# EAGLE design PetFeeder2 (EAGLE 9.6.2)
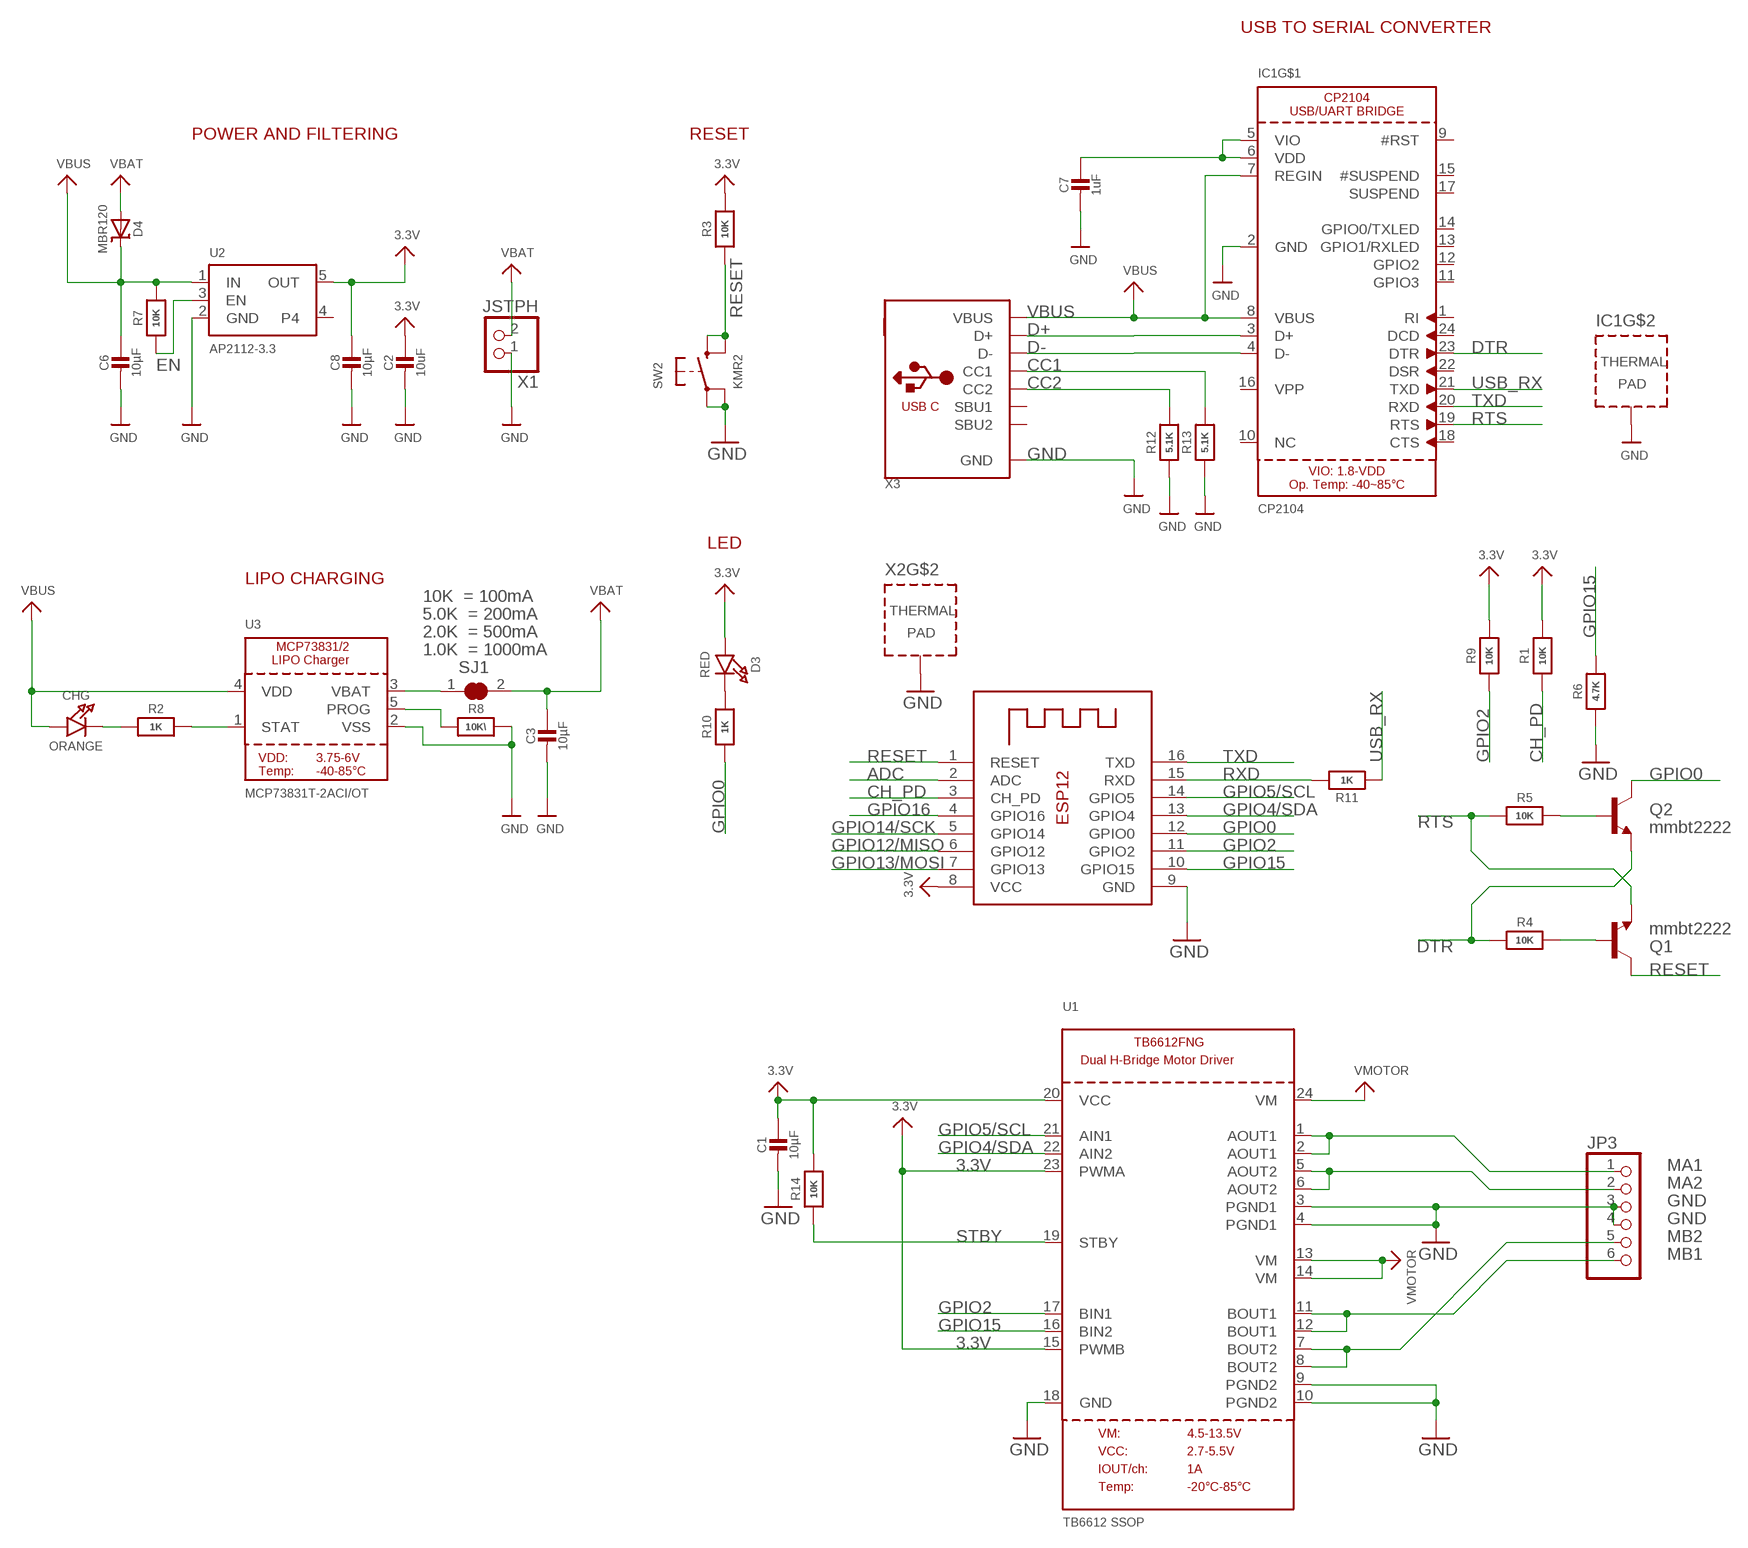
[diagram p0: schematic, sheet 1]

## Parts
C1  10µF  CAP_CERAMIC0805-NOOUTLINE  [0805-NO]
C2  10uF  CAP_CERAMIC0805-NOOUTLINE  [0805-NO]
C3  10µF  CAP_CERAMIC0805-NOOUTLINE  [0805-NO]
C6  10µF  CAP_CERAMIC0805-NOOUTLINE  [0805-NO]
C7  1uF  CAP_CERAMIC0603_NO  [0603-NO]
C8  10µF  CAP_CERAMIC0805-NOOUTLINE  [0805-NO]
CHG  ORANGE  LED0805_NOOUTLINE  [CHIPLED_0805_NOOUTLINE]
D3  RED  LED0805_NOOUTLINE  [CHIPLED_0805_NOOUTLINE]
D4  MBR120  DIODE-SCHOTTKYSOD-123  [SOD-123]
IC1  CP2104  [QFN24_4MM_SMSC]
JP3  PINHD-1X6CB  [1X06-CLEANBIG]
Q1  mmbt2222  TRANSISTOR_NPNSOT23-3  [SOT23-3]
Q2  mmbt2222  TRANSISTOR_NPNSOT23-3  [SOT23-3]
R1  10K  RESISTOR_0603_NOOUT  [0603-NO]
R2  1K  RESISTOR_0603_NOOUT  [0603-NO]
R3  10K  RESISTOR_0603_NOOUT  [0603-NO]
R4  10K  RESISTOR_0603_NOOUT  [0603-NO]
R5  10K  RESISTOR_0603_NOOUT  [0603-NO]
R6  4.7K  RESISTOR_0603_NOOUT  [0603-NO]
R7  10K  RESISTOR_0603_NOOUT  [0603-NO]
R8  10K\  RESISTOR_0603_NOOUT  [0603-NO]
R9  10K  RESISTOR_0603_NOOUT  [0603-NO]
R10  1K  RESISTOR_0603_NOOUT  [0603-NO]
R11  1K  RESISTOR_0603MP  [_0603MP]
R12  5.1K  RESISTOR_0603_NOOUT  [0603-NO]
R13  5.1K  RESISTOR_0603_NOOUT  [0603-NO]
R14  10K  RESISTOR0805_NOOUTLINE  [0805-NO]
SJ1  SOLDERJUMPER_CLOSED  [SOLDERJUMPER_CLOSEDWIRE]
SW2  KMR2  SWITCH_TACT_SMT4.6X2.8  [BTN_KMR2_4.6X2.8]
U1  TB6612 SSOP  TB6612FNGSSOP  [SSOP24]
U2  AP2112-3.3  VREG_SOT23-5  [SOT23-5]
U3  MCP73831T-2ACI/OT  MCP73831/2  [SOT23-5]
X1  JSTPH  CON_JST_PH_2PIN  [JSTPH2]
X2  ESP-12  ESP-12S  [ESP-12S]
X3  USB_C  [USB_C_CUSB31-CFM2AX-01-X]

## Nets
3.3V: C1.1 C2.1 C8.1 D3.A R1.2 R3.2 R9.2 R14.2 U1.15(PWMB) U1.20(VCC) U1.23(PWMA) U2.5(OUT) X2.8(VCC)
ADC: X2.2(ADC)
CC1: R13.2 X3.A5(CC1)
CC2: R12.2 X3.B5(CC2)
CH_PD: R1.1 X2.3(CH_PD)
D+: IC1.3(D+) X3.A6(D+) X3.B6(D+)
D-: IC1.4(D-) X3.A7(D-) X3.B7(D-)
DTR: IC1.23(DTR) Q2.2(E) R4.1
EN: R7.1 U2.3(EN)
GND: C1.2 C2.2 C3.2 C6.2 C7.2 C8.2 IC1.2(GND) IC1.THERM(TP) JP3.3 JP3.4 R6.1 R8.2 R12.1 R13.1 SW2.A'(P1) SW2.A(P) U1.3(PGND1) U1.4(PGND1) U1.9(PGND2) U1.10(PGND2) U1.18(GND) U2.2(GND) U3.2(VSS) X1.1 X2.9(GND) X2.P$1(TP) X3.A1B12(GND) X3.B1A12(GND)
GPIO0: Q2.3(C) R10.1 X2.12(GPIO0)
GPIO2: R9.1 U1.17(BIN1) X2.11(GPIO2)
GPIO4/SDA: U1.22(AIN2) X2.13(GPIO4)
GPIO5/SCL: U1.21(AIN1) X2.14(GPIO5)
GPIO12/MISO: X2.6(GPIO12)
GPIO13/MOSI: X2.7(GPIO13)
GPIO14/SCK: X2.5(GPIO14)
GPIO15: R6.2 U1.16(BIN2) X2.10(GPIO15)
GPIO16: X2.4(GPIO16)
MA1: JP3.1 U1.1(AOUT1) U1.2(AOUT1)
MA2: JP3.2 U1.5(AOUT2) U1.6(AOUT2)
MB1: JP3.6 U1.11(BOUT1) U1.12(BOUT1)
MB2: JP3.5 U1.7(BOUT2) U1.8(BOUT2)
N$1: CHG.C R2.1
N$3: R2.2 U3.1(STAT)
N$4: R8.1 U3.5(PROG)
N$5: D3.C R10.2
N$7: SJ1.1 U3.3(VBAT)
N$8: C7.1 IC1.5(VIO) IC1.6(VDD)
N$12: Q1.1(B) R4.2
N$13: Q2.1(B) R5.2
RESET: Q1.3(C) R3.1 SW2.B'(S1) SW2.B(S) X2.1(RESET)
RTS: IC1.19(RTS) Q1.2(E) R5.1
RXD: R11.2 X2.15(RXD)
STBY: R14.1 U1.19(STBY)
TXD: IC1.20(RXD) X2.16(TXD)
USB_RX: IC1.21(TXD) R11.1
VBAT: C3.1 D4.A SJ1.2 X1.2
VBUS: C6.1 CHG.A D4.C IC1.7(REGIN) IC1.8(VBUS) R7.2 U2.1(IN) U3.4(VDD) X3.A4B9(VBUS) X3.B4A9(VBUS)
VMOTOR: U1.13(VM) U1.14(VM) U1.24(VM)
Unconnected: IC1.1(RI) IC1.9(#RST) IC1.10(NC) IC1.11(GPIO3) IC1.12(GPIO2) IC1.13(GPIO1/RXLED) IC1.14(GPIO0/TXLED) IC1.15(#SUSPEND) IC1.16(VPP) IC1.17(SUSPEND) IC1.18(CTS) IC1.22(DSR) IC1.24(DCD) U2.4 X3.A8(SBU1) X3.B8(SBU2)

## Notes on the sheet
- USB TO SERIAL CONVERTER
- POWER AND FILTERING | RESET
- LED
- LIPO CHARGING
- 10K  = 100mA
- 5.0K  = 200mA
- 2.0K  = 500mA
- 1.0K  = 1000mA

## Library data of the parts
C1-C3 C6-C8 = microbuilder:CAP_CERAMIC: Ceramic Capacitors For new designs, use the packages preceded by an '_' character since they are more reliable: The following footprints should be used on most boards: _0402 - Standard footprint for regular board layouts _0603 - Standard footprint for regular board layouts _0805 - Standard footprint for regular board layouts _1206 - Standard footprint for regular board layouts For extremely tight-pitch boards where space is at a premium, the following 'micro-pitch' footprints can be used (smaller pads, no silkscreen outline, etc.): _0402MP - Micro-pitch footprint for very dense/compact boards _0603MP - Micro-pitch footprint for very dense/compact boards _0805MP - Micro-pitch footprint for very dense/compact boards _1206MP - Micro-pitch footprint for very dense/compact boards
CHG D3 = microbuilder:LED: LED 0603 - 0603 Surface Mount Package 2mA: Green LED - Low Power (3.9mcd, 2ma, 1.7Vf) - Digikey: 475-2709-2-ND Orange LED - Low Power (9.8mcd, 2ma, 1.8Vf) - Digikey: 475-1194-2-ND Red LED - Low Power (5mcd, 2ma, 1.8Vf) - Digikey: 475-1195-2-ND Yellow LED - Low Power (7mcd, 2ma, 1.8Vf) - Digikey: 475-1196-2-ND 5mA: Blue LED - Low Power (17mcd, 5ma, 2.9Vf) - Digikey: LNJ937W8CRACT-ND 0805 - 0805 Surface Mount Package 2mA: Red LED (8.8mcd, 2mA, 1.8Vf, Clear) - Low Power [Digikey: 475-2510-1-ND] Green LED (5mcd, 2mA, 1.8Vf, Clear) - Low Power [Digikey: 475-2730-1-ND] Yellow LED (11.3mcd, 2mA, 1.8Vf, Clear) - Low Power [Digikey: 475-2555-1-ND] 20mA: Red LED (104mcd, 20mA, Diffused) - LS R976 [Digikey: 475-1278-6-ND] Red LED (12mcd, 20mA, 2.0Vf, Clear) - APT2012EC [Digikey: 754-1128-1-ND] Green LED (15mcd, 20mA, 2.2Vf, Clear) - APT2012GC [Digikey: 754-1131-1-ND] Orange LED (160mcd, 20mA, 2.1Vf, Clear) - APT2012SECK [Digikey: 754-1130-1-ND] 1206 - 1206 Surface Mount Package Green LED (26mcd, 20mA, Diffused) - LG N971 [Digikey: 475-1407-6-ND] Red LED (15mcd, 20mA, Diffused) - LH N974 [Digikey: 475-1416-6-ND] Cree - Cree High-Power Surface Mount LEDs XPEBWT-L1-0000-00D50 - White 111lm 350mA 2.9Vf 6200K 110° XTEAWT-00-0000-00000LEE3 - White 114lm 350mA 2.85Vf 5000K 115° Everlight - Everlight 45-21 Series Surface Mount LEDs 45-21/QK2C-B2832AC2CB2/2T - Warm White 2000mcd 20mA 3.25Vf 3050K 120° 45-21/LK2C-B38452C4CB2/2T - Nuetral White 2000mcd 20mA 3.25Vf 4150K 120° 45-21/LK2C-B50634C6CB2/2T - Cold White 2200mcd 20mA 3.25Vf 5650K 120° PLCC2 Reverse Mount LS T77K-J1L2-1-0-2-R18-Z - Red 11.25mcd 2mA 1.8Vf 630nm 120° LO T77K-L1M2-24-Z - Orange 19.6mcd 2mA 1.8Vf 606nm 120° LY T77K-K2M1-26-Z - Yellow 15.7mcd 2mA 1.8Vf 587nm 120°
D4 = microbuilder:DIODE-SCHOTTKY
IC1 = microbuilder:CP2104: CP2104 - USB to UART Bridge VDD Output: 3.45V
JP3 = adafruit:PINHD-1X6: PIN HEADER
Q1 Q2 = SparkFun:TRANSISTOR_NPN: Transistor NPN BJT configuration in SOT23 package. MMBT2222 is the common NPN we use. Double check BCE configuration again layout.
R1-R14 = microbuilder:RESISTOR: Resistors For new designs, use the packages preceded by an '_' character since they are more reliable: The following footprints should be used on most boards: _0402 - Standard footprint for regular board layouts _0603 - Standard footprint for regular board layouts _0805 - Standard footprint for regular board layouts _1206 - Standard footprint for regular board layouts For extremely tight-pitch boards where space is at a premium, the following 'micro-pitch' footprints can be used (smaller pads, no silkscreen outline, etc.): _0402MP - Micro-pitch footprint for very dense/compact boards _0603MP - Micro-pitch footprint for very dense/compact boards _0805MP - Micro-pitch footprint for very dense/compact boards _1206MP - Micro-pitch footprint for very dense/compact boards
SJ1 = microbuilder:SOLDERJUMPER_CLOSED: Solder Jumper - Closed These solder jumpers are closed by default CLOSEDWIRE - 10 mil trace between pads that can be cut and resoldered later CLOSEDPERM - 63 mil trace between pads for a permanent connection (used to 'bridge' two signals, a shameless hack for Eagle). Can double as a test point as well (no cream layer)
SW2 = microbuilder:SWITCH_TACT_SMT: SMT Tact Switches 6x6mm - Digikey: P12940SCT-ND KMR2 (4.6x2.8mm) - Digikey: 401-1426-1-ND EVQ-PQHB55 - Light Touch, 160GF (4.5x4.5mm) - Digikey: P8090SCT-ND KMT0 - KMT021 NGJ LHS (etc.) IP68/Waterproof - Digikey: CKN10289CT-ND
U1 = microbuilder:TB6612FNG: TB6612FNG Dual H-Bridge Motor Driver
U2 = microbuilder:VREG_SOT23-5: SOT23-5 Fixed Voltage Regulators Part Current Out V Out V In V Dropout θJA (°C/W) TJ (°C) Digikey Part No. ADP121 150mA 3.3V 3.4-5.5V 0.09V @ 150mA -- -- ADP121-AUJZ33R7CT-ND ADP121 150mA 3.0V 3.1-5.5V 0.09V @ 150mA -- -- ADP121-AUJZ30R7CT-ND ADP122 300mA 3.3V 3.4-5.5V 0.085V @ 300mA -- -- ADP122AUJZ-3.3-R7CT-ND ADP1712 300mA 3.3V 3.5-5.5V 0.17V @ 300mA -- -- ADP1712AUJZ-3.3-R7TR-ND AP7311 (Low Cost) 150mA 3.3V 3.5-6V 0.15V @ 150mA -- -- AP7311-33WG-7DICT-ND LD39015M18R 150mA 1.8V 1.9V-5.5V 0.08V @ 100mA -- -- 497-6977-1-ND LP2985A-33DBVR 150mA 3.3V 3.3-16V 0.28V @ 150mA 206 150 296-18479-1-ND MCP1824T-3302E/OT 300mA 3.3V 3.5V-6V 0.2V @ 300mA -- -- MCP1824T-3302E/OTCT-ND MIC5205-2.5YM5 TR 150mA 2.5V 2.7-16V 0.165V @ 150mA -- -- 576-1257-2-ND MIC5205-3.0YM5 TR 150mA 3.0V 3.2V-16V 0.165V @ 150mA -- -- 576-1258-2-ND MIC5205-3.3YM5 TR 150mA 3.3V 3.5V-16V 0.165V @ 150mA -- -- 576-1259-2-ND TPS780330220 150mA 3.3V+2.2V 3.6-5.5V 250mV Max -- -- 296-23332-1-ND TDA3663/N1,135 100mA 3.3V 3.5-45V 0.18V @ 50mA -- -- 568-5343-1-ND Max operating temp can be calculated using θJA, TJ (max junction temperature), and power in watts. Set the "Maximum Ambient Temperature" until it reaches TJ ("Max Junction Temperature"), which is the absolute limit for safe use of the regulator: Heat Sink Temperature Calculator <http://www.daycounter.com/Calculators/Heat-Sink-Temperature-Calculator.phtml> For example, With 12V source into a 3.3V LP2985 and a 30mA load, we are dissipating (12V-3.3V) * 0.03A = 0.261W. With a θJA of 206 °C/W, a TJ of 150°C, and 261mW we can safely use the chip without a heat sink up to 75°C (=147.1°C Junction Temperature).
U3 = microbuilder:MCP73831/2: MCP73831/2 LIPO Charger VDD: 3.75 - 6V Temp -40 - 85°C Programmable Charge Rate: 15-500mA NOTE: STAT is a tri-state logic output on the MCP73831 and an open-drain output on the MCP73832. SOT23-5 with 4.2V output and tri-state logic on STAT = MCP73831T-2ACI/OT
X1 = microbuilder:CON_JST_PH_2PIN: JST 2-Pin Right-Angle Connector PH-Series - 4UConnector: 17311 SH-Series - 4UConnector: 07278
X2 = microbuilder:ESP-12S
X3 = microbuilder:USB_C: USB Type-C USB 2.0 Connector

## Board
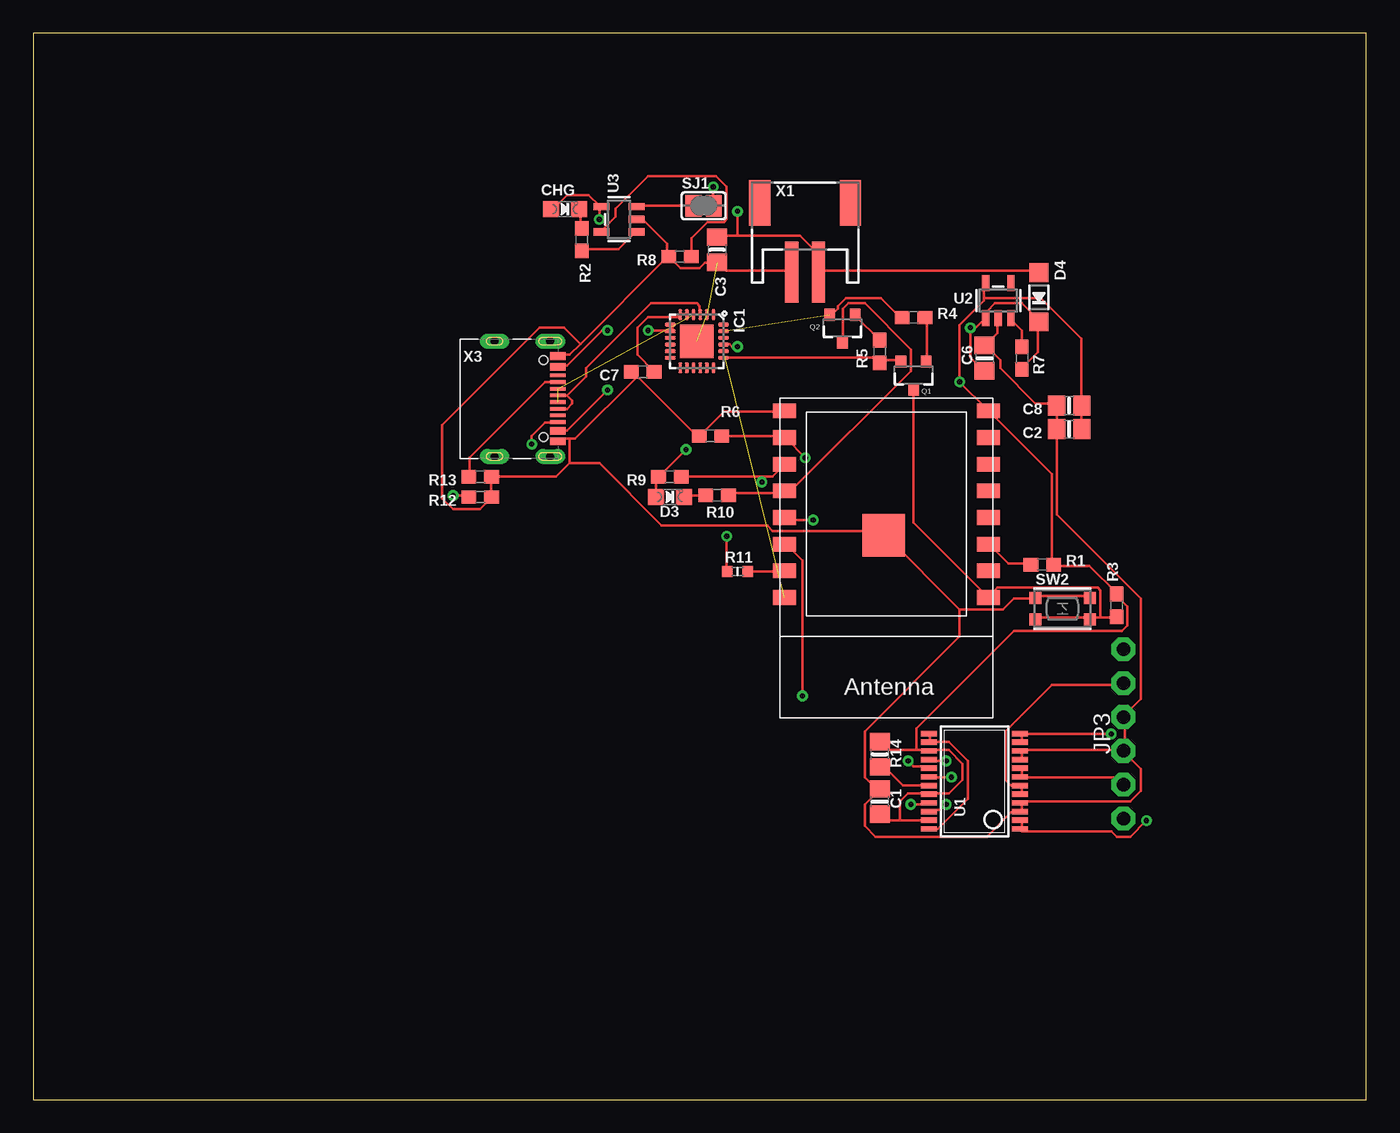
[diagram p1: board, top side]
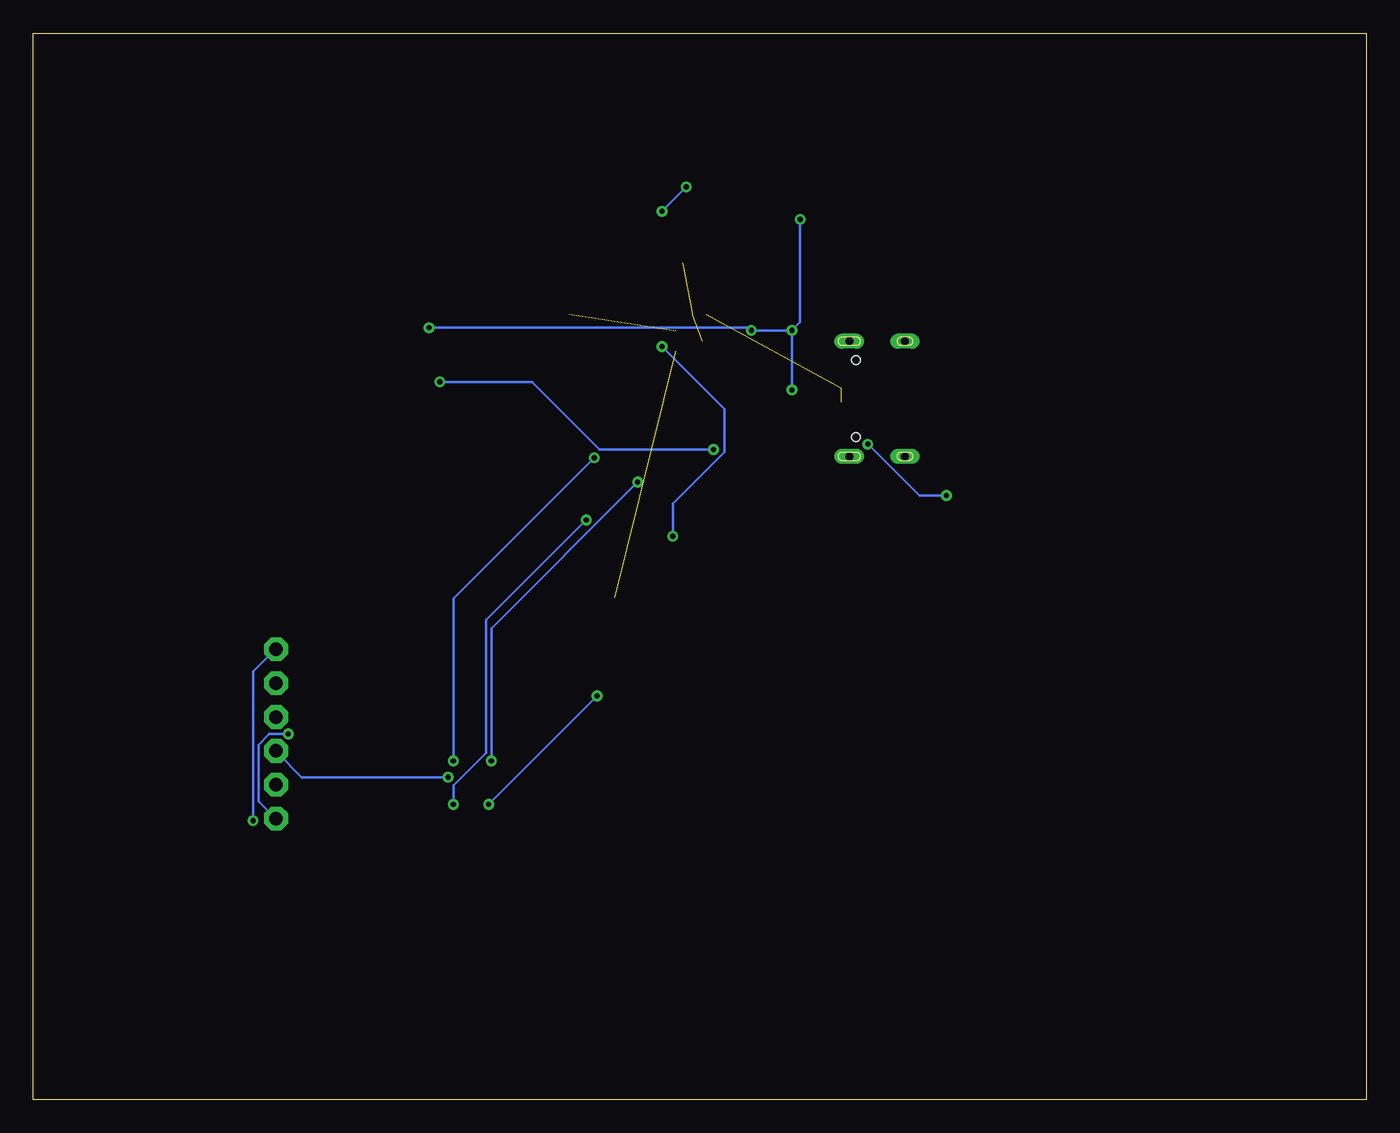
[diagram p2: board, bottom side, seen from below]

Size 100 x 80 mm. Coordinates in mm from the lower left corner, seen from the top.
Outline: 0,0 100,0 100,80 0,80 0,0
Copper layers (1*16): Top 0.035mm / dielectric 1.5mm / Bottom 0.035mm
Design rules "main": minimum track width 8mil, minimum drill 15.5mil, track to track 8mil, track to pad 8mil, pad to pad 8mil, via to via 8mil, smd to smd 8mil, copper to edge 10mil, drill to drill 8mil, minimum pad ring 10mil, minimum via ring 8mil, stop-mask expansion 2mil, vias tented up to drill 20mil, thermal gap 10mil

### Footprints (pad centres in the part's own frame; a part is rotated, then mirrored left to right if it is on the bottom)
0805-NO = smd 1.3 x 1.5: 1 -0.95,0; 2 0.95,0
0603-NO = smd 1.1 x 1: 1 -0.85,0; 2 0.85,0
CHIPLED_0805_NOOUTLINE = smd 1.2 x 1.2: A 0,-1.05; C 0,1.05
SOD-123 = smd 1.4 x 1.4: A 1.85,0; C -1.85,0
QFN24_4MM_SMSC = smd 0.8 x 0.28: 1 -2,1.25; 2 -2,0.75; 3 -2,0.25; 4 -2,-0.25; 5 -2,-0.75; 6 -2,-1.25; 13 2,-1.25; 14 2,-0.75; 15 2,-0.25; 16 2,0.25; 17 2,0.75; 18 2,1.25 | smd 0.28 x 0.8: 7 -1.25,-2; 8 -0.75,-2; 9 -0.25,-2; 10 0.25,-2; 11 0.75,-2; 12 1.25,-2; 19 1.25,2; 20 0.75,2; 21 0.25,2; 22 -0.25,2; 23 -0.75,2; 24 -1.25,2 | smd 2.5 x 2.5: THERM 0,0
1X06-CLEANBIG = drill 1.016 pad 1.778 octagon: 1 -6.35,0; 2 -3.81,0; 3 -1.27,0; 4 1.27,0; 5 3.81,0; 6 6.35,0
SOT23-3 = smd 0.8 x 0.9: 1 -0.95,-1; 2 0.95,-1; 3 0,1.1
_0603MP = smd 0.8 x 0.8: 1 -0.762,0; 2 0.762,0
SOLDERJUMPER_CLOSEDWIRE = smd 1.168 x 1.6: 1 -0.762,0; 2 0.762,0 | smd 0.635 x 0.203: WIRE 0,0
BTN_KMR2_4.6X2.8 = smd 0.9 x 0.9: A 2.05,0.8; A' -2.05,0.8; B 2.05,-0.8; B' -2.05,-0.8
SSOP24 = smd 0.4 x 1.2: 1 -3.575,-3.42; 2 -2.925,-3.42; 3 -2.275,-3.42; 4 -1.625,-3.42; 5 -0.975,-3.42; 6 -0.325,-3.42; 7 0.325,-3.42; 8 0.975,-3.42; 9 1.625,-3.42; 10 2.275,-3.42; 11 2.925,-3.42; 12 3.575,-3.42; 13 3.575,3.42; 14 2.925,3.42; 15 2.275,3.42; 16 1.625,3.42; 17 0.975,3.42; 18 0.325,3.42; 19 -0.325,3.42; 20 -0.975,3.42; 21 -1.625,3.42; 22 -2.275,3.42; 23 -2.925,3.42; 24 -3.575,3.42
SOT23-5 = smd 0.55 x 1.2: 1 -0.95,-1.3; 2 0,-1.3; 3 0.95,-1.3; 4 0.95,1.3; 5 -0.95,1.3
JSTPH2 = smd 1 x 4.6: 1 -1,-3.7; 2 1,-3.7 | smd 1.6 x 3.4: NC1 -3.4,1.5; NC2 3.4,1.5
ESP-12S = smd 1.7 x 1.1: 1 -7.65,5.77; 2 -7.65,3.77; 3 -7.65,1.77; 4 -7.65,-0.23; 5 -7.65,-2.23; 6 -7.65,-4.23; 7 -7.65,-6.23; 8 -7.65,-8.23; 9 7.65,-8.23; 10 7.65,-6.23; 11 7.65,-4.23; 12 7.65,-2.23; 13 7.65,-0.23; 14 7.65,1.77; 15 7.65,3.77; 16 7.65,5.77 | smd 3.2 x 3.2: P$1 0.2,1.1
USB_C_CUSB31-CFM2AX-01-X = smd 0.575 x 1.15: A1B12 -3.2,7.355; A4B9 -2.4,7.355; B1A12 3.2,7.355; B4A9 2.4,7.355 | smd 0.275 x 1.15: A5 -1.25,7.355; A6 -0.25,7.355; A7 0.25,7.355; A8 1.25,7.355; B5 1.75,7.355; B6 0.75,7.355; B7 -0.75,7.355; B8 -1.75,7.355 | drill 0.6 pad 1 long: M1 -4.32,6.78; M2 4.32,6.78; M3 -4.32,2.6; M4 4.32,2.6 | hole 0.65: 2.89,6.28; -2.89,6.28

### Placement (x,y rotation side)
C1  63.5,22.35 90 top
C2  77.72,50.29 180 top
C3  51.31,63.75 270 top
C6  71.37,55.63 90 top
C7  45.72,54.61 180 top
C8  77.72,52.07 180 top
CHG  39.88,66.8 270 top
D3  47.75,45.21 270 top
D4  75.44,60.2 90 top
IC1  49.78,56.9 270 top
JP3  81.79,27.43 270 top
Q1  66.04,54.36 180 top
Q2  60.71,57.91 180 top
R1  75.69,40.13 0 top
R2  41.15,64.52 270 top
R3  81.28,37.08 90 top
R4  66.04,58.67 0 top
R5  63.5,56.13 90 top
R6  50.8,49.78 0 top
R7  74.17,55.63 270 top
R8  48.51,63.25 180 top
R9  47.75,46.74 180 top
R10  51.31,45.34 180 top
R11  52.83,39.62 0 top
R12  33.53,45.21 180 top
R13  33.53,46.74 180 top
R14  63.5,25.91 90 top
SJ1  50.29,67.06 0 top
SW2  77.22,36.83 0 top
U1  70.61,23.88 90 top
U2  72.39,59.94 0 top
U3  43.94,66.04 90 top
X1  57.91,65.79 0 top
X2  64.01,43.43 180 top
X3  32,52.58 270 top

### Tracks (layer width: path | path; a pad name or v marks a point on that pad's centre or on a via)
3.3V  (via drill 0.39)
  Top 0.203: 66.24,26.21 64.21,26.21 63.6,26.82 R14.2 | 66.24,26.21 67.06,26.21 U1.15 67.26,26.21 68.68,26.21 69.7,25.2 69.7,23.98 68.68,22.96 67.26,22.96 U1.20 67.06,22.96 65.63,22.96 65.02,22.35 65.02,20.93 | 65.02,20.93 64.01,20.93 63.6,21.34 C1.1 | 65.02,20.93 67.06,20.93 U1.23 | C2.1 78.64,50.39 78.64,52.02 C8.1 78.64,52.22 78.64,57.1 75.59,60.15 71.32,60.15 | D3.A 46.74,45.31 46.74,46.74 R9.2 46.94,46.74 v48.97,48.77 | 71.32,60.15 71.32,59.94 69.49,58.12 v69.49,53.85 71.53,51.82 X2.8 71.73,51.61 76.4,46.94 76.4,40.23 R1.2 76.61,40.03 79.25,40.03 81.28,38 R3.2 81.28,37.8 82.09,36.98 82.09,35.56 81.69,35.15 73.56,35.15 66.24,27.84 66.24,26.21 | 71.32,60.15 71.32,61.16 U2.5
  Bottom 0.203: v48.97,48.77 57.51,48.77 62.59,53.85 v69.49,53.85
CC1
  Top 0.203: R13.2 32.72,46.74 32.72,48.16 38.41,53.85 39.22,53.85 X3.A5
CC2  (via drill 0.39)
  Top 0.203: v31.5,45.31 32.51,45.31 R12.2 | v37.39,49.17 37.39,49.78 38.41,50.8 39.22,50.8 X3.B5
  Bottom 0.203: v31.5,45.31 33.53,45.31 v37.39,49.17
CH_PD
  Top 0.203: R1.1 74.78,40.23 73.15,40.23 71.73,41.66 X2.3
D+
  Top 0.203: 40.03,52.83 41.45,54.25 41.45,54.86 46.33,59.74 49.78,59.74 49.99,59.54 49.99,58.93 IC1.3 | 40.03,52.83 39.42,52.83 X3.A6 | 40.03,52.83 40.44,52.43 40.44,52.22 40.03,51.82 39.42,51.82 X3.B6
D-  (2 unrouted)
DTR  (1 unrouted)
  Top 0.203: Q2.2 59.94,58.93 60.35,59.33 60.35,59.54 60.96,60.15 63.6,60.15 65.02,58.73 R4.1
EN
  Top 0.203: R7.1 74.17,57.71 73.36,58.52 U2.3
GND  (via drill 0.39)  (2 unrouted)
  Top 0.203: U3.2 45.72,66.04 47.55,64.21 47.55,63.4 R8.2 | 41.05,56.69 47.55,63.2 R8.2 | 41.05,56.69 40.23,55.88 39.42,55.88 X3.A1B12 | R8.2 47.75,63.2 48.56,62.38 49.99,62.38 50.39,62.79 51.21,62.79 C3.2 51.41,62.79 52.02,62.18 56.9,62.18 X1.1 | 45.31,54.25 44.91,54.66 C7.2 45.31,54.25 | 45.31,54.25 49.78,49.78 R6.1 49.99,49.78 51.82,51.61 56.29,51.61 X2.9 | 40.23,49.58 40.64,49.58 45.31,54.25 | 40.23,49.58 39.42,49.58 X3.B1A12 | 40.23,47.75 39.22,46.74 R13.1 34.34,46.74 34.34,45.31 R12.1 34.34,45.11 33.53,44.3 31.5,44.3 30.68,45.11 30.68,50.6 38,57.91 39.83,57.91 41.05,56.69 | 40.23,49.58 40.23,47.75 | SW2.A 79.25,37.8 75.18,37.8 SW2.A' 74.98,37.59 73.56,37.59 72.75,36.78 69.49,36.78 | 69.49,36.78 64.01,42.27 X2.P$1 63.8,42.47 63.6,42.67 55.47,42.67 55.07,43.08 47.14,43.08 42.47,47.75 40.23,47.75 | U2.2 72.34,58.52 72.34,57.51 71.53,56.69 C6.2 71.53,56.49 72.54,55.47 72.54,54.86 75.18,52.22 76.61,52.22 C8.2 76.81,52.02 76.81,50.39 C2.2 76.81,50.19 76.81,43.89 83.11,37.59 83.11,30.07 81.89,28.85 JP3.3 81.89,28.65 81.89,26.21 JP3.4 | U1.9 74.17,25.6 74.17,26.01 U1.10 74.17,26.21 81.69,26.21 JP3.4 | v68.89,24.18 67.26,24.18 U1.18 | JP3.4 81.89,26.01 83.11,24.79 83.11,23.16 82.3,22.35 74.17,22.35 U1.4 74.17,22.15 74.17,21.74 U1.3 73.97,21.54 73.36,21.54 71.53,19.71 63.2,19.71 62.38,20.52 62.38,22.15 63.4,23.16 | 69.49,36.78 69.49,34.75 62.38,27.64 62.38,24.18 63.4,23.16 | 63.4,23.16 C1.2
  Bottom 0.203: v68.89,24.18 79.86,24.18 81.69,26.01 JP3.4
GPIO0
  Top 0.203: Q2.3 60.76,56.9 60.76,59.33 61.16,59.74 62.38,59.74 65.84,56.29 65.84,54.66 56.9,45.72 56.49,45.72 X2.12 56.29,45.52 52.22,45.52 R10.1
GPIO2  (via drill 0.39)
  Top 0.203: 54.66,46.74 55.47,46.74 56.29,47.55 X2.11 | 54.66,46.74 R9.1 | v65.63,25.4 66.04,24.99 67.06,24.99 U1.17 | 54.66,46.74 v54.66,46.33
  Bottom 0.203: v65.63,25.4 65.63,35.36 v54.66,46.33
GPIO4/SDA  (via drill 0.39)
  Top 0.203: v68.48,22.15 68.07,21.74 67.26,21.74 U1.22 | v58.52,43.48 56.49,43.48 X2.13
  Bottom 0.203: v68.48,22.15 68.48,23.57 66.04,26.01 66.04,35.97 v58.52,43.48
GPIO5/SCL  (via drill 0.39)
  Top 0.203: v65.84,22.15 67.06,22.15 U1.21 | v57.71,30.28 57.71,40.44 56.49,41.66 X2.14
  Bottom 0.203: v57.71,30.28 v65.84,22.15
GPIO15  (via drill 0.39)
  Top 0.203: R6.2 56.29,49.78 X2.10 56.49,49.58 v57.91,48.16 | v68.48,25.4 67.26,25.4 U1.16
  Bottom 0.203: v68.48,25.4 68.48,37.59 v57.91,48.16
MA1  (via drill 0.39)
  Top 0.203: U1.2 74.17,20.93 74.17,20.32 U1.1 74.17,20.12 80.87,20.12 81.28,19.71 82.3,19.71 v83.52,20.93
  Bottom 0.203: v83.52,20.93 83.52,32.11 81.89,33.73 JP3.1
MA2
  Top 0.203: U1.5 74.17,22.96 74.17,23.37 U1.6 73.97,23.57 73.36,23.57 72.95,23.98 72.95,27.64 76.4,31.09 81.69,31.09 JP3.2
MB1  (via drill 0.39)
  Top 0.203: 74.17,27.43 74.17,26.82 U1.11 | v80.87,27.43 74.17,27.43 | 74.17,27.43 U1.12
  Bottom 0.203: v80.87,27.43 82.3,27.43 83.11,26.62 83.11,22.35 81.89,21.13 JP3.6
MB2
  Top 0.203: U1.8 74.17,24.79 74.17,24.38 U1.7 74.17,24.18 81.28,24.18 81.69,23.77 JP3.5
N$1
  Top 0.203: R2.1 41.05,65.43 41.05,66.65 CHG.C
N$3
  Top 0.203: R2.2 41.25,63.8 43.89,63.8 45.11,65.02 U3.1
N$4
  Top 0.203: R8.1 49.38,63.4 49.38,64.62 50.6,65.84 51.82,65.84 52.02,66.04 52.02,68.48 51.21,69.29 46.13,69.29 43.69,66.85 43.69,66.24 42.67,65.23 U3.5
N$5
  Top 0.203: R10.2 50.39,45.31 48.97,45.31 D3.C
N$7
  Top 0.203: SJ1.1 45.31,67.06 U3.3
N$8
  Top 0.203: IC1.5 48.97,58.93 48.56,58.93 IC1.6 48.56,58.73 46.13,58.73 45.31,57.91 45.31,55.88 46.53,54.66 C7.1
N$12
  Top 0.203: Q1.1 67.06,55.47 67.06,58.52 R4.2
N$13
  Top 0.203: Q2.1 61.77,58.73 63.4,57.1 R5.2
RESET
  Top 0.203: SW2.B' 75.18,36.17 79.25,36.17 SW2.B 79.45,36.17 80.06,36.17 | 80.06,36.17 81.28,36.17 R3.1 | Q1.3 66.04,43.28 71.53,37.8 X2.1 71.73,37.8 72.34,38.41 79.86,38.41 80.06,38.2 80.06,36.17
RTS
  Top 0.203: IC1.19 51.82,55.68 63.2,55.68 63.4,55.47 R5.1 63.6,55.47 65.02,55.47 Q1.2
RXD
  Top 0.203: R11.2 56.29,39.62 X2.15
STBY
  Top 0.203: U1.19 67.06,23.57 65.23,23.57 64.01,24.79 63.6,24.79 R14.1
TXD  (1 unrouted)
USB_RX  (via drill 0.39)
  Top 0.203: v52.02,42.27 52.02,39.62 R11.1 | v52.83,56.49 52.43,56.49 52.22,56.69 51.82,56.69 IC1.21
  Bottom 0.203: v52.02,42.27 52.02,44.7 48.16,48.56 48.16,51.82 v52.83,56.49
VBAT  (via drill 0.39)
  Top 0.203: D4.A 75.39,62.18 58.93,62.18 X1.2 58.73,62.18 58.73,63.6 57.51,64.82 52.83,64.82 | 52.83,64.82 51.41,64.82 C3.1 | v51,68.48 51,67.06 SJ1.2 | 52.83,64.82 v52.83,66.65
  Bottom 0.203: v52.83,66.65 v51,68.48
VBUS  (via drill 0.39)
  Top 0.203: 70.51,57.71 70.31,57.51 70.31,55.68 71.32,54.66 C6.1 | 70.51,57.71 71.32,58.52 U2.1 71.53,58.73 71.53,59.13 72.14,59.74 74.17,59.74 75.39,58.52 D4.C 75.39,58.32 75.39,56.08 74.17,54.86 R7.2 | CHG.A 39.01,66.85 40.03,67.87 41.66,67.87 42.47,67.06 U3.4 42.47,66.85 v42.47,66.04 | IC1.7 47.95,58.12 47.95,57.71 IC1.8 47.75,57.71 v46.13,57.71 | v43.08,57.71 42.67,57.71 40.03,55.07 39.42,55.07 X3.A4B9 | v43.08,53.24 40.03,50.19 39.42,50.19 X3.B4A9 | v70.31,57.91 70.51,57.71
  Bottom 0.203: v43.08,57.71 v46.13,57.71 46.33,57.91 v70.31,57.91 | v43.08,57.71 v43.08,53.24 | v42.47,66.04 42.47,58.32 v43.08,57.71
VMOTOR
  Top 0.203: 67.26,26.82 68.68,26.82 70.1,25.4 70.1,22.55 67.87,20.32 67.26,20.32 U1.24 | 67.26,26.82 67.26,27.43 U1.13 | 67.26,26.82 U1.14